# EAGLE design IFB-40002-R01 - I2C_Joystick (EAGLE 9.6.2)
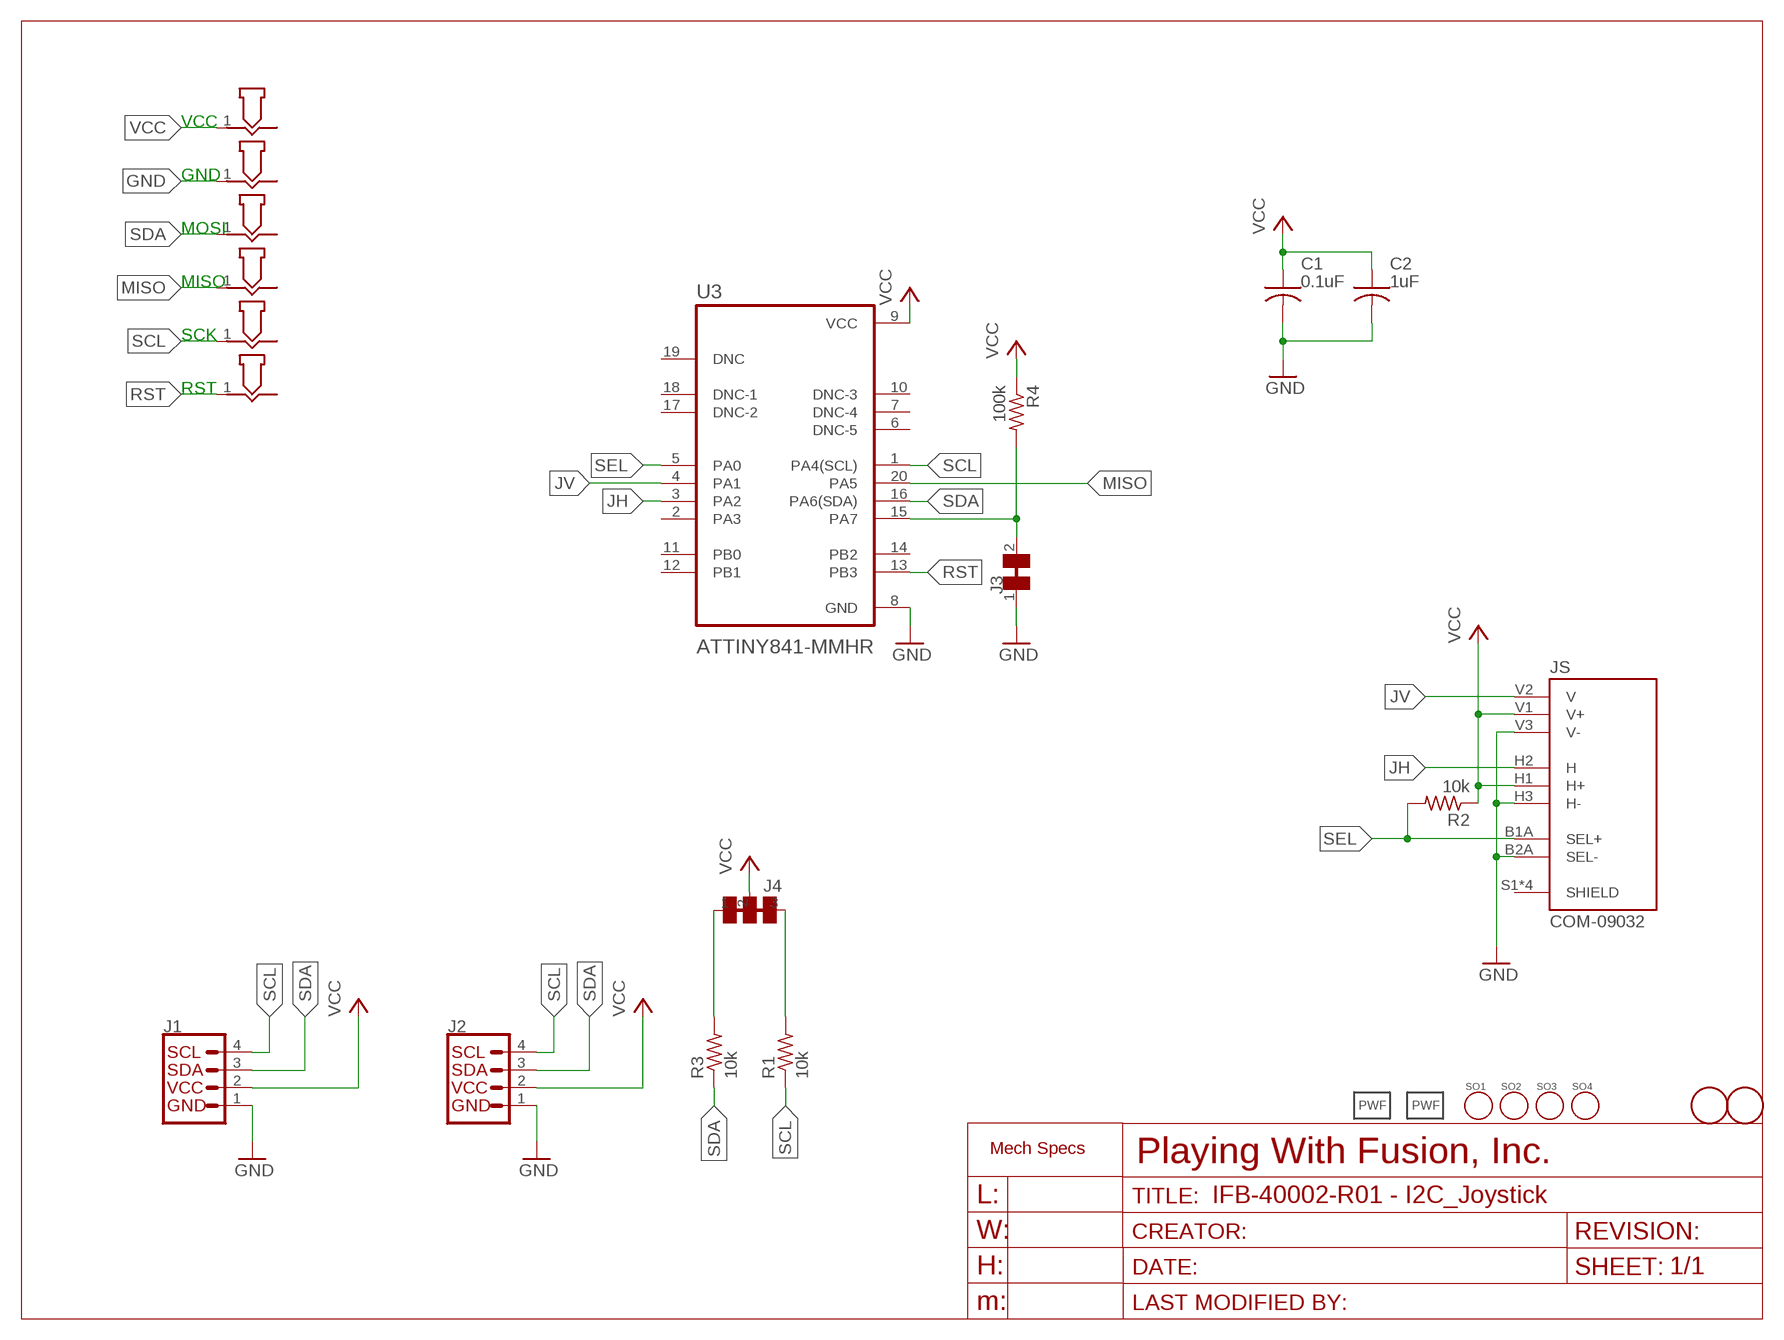
[diagram p0: schematic, sheet 1]

## Parts
C1  0.1uF  C-USC0603K  [C0603K]
C2  1uF  C-USC0603K  [C0603K]
GND  POGO_PAD  [P50_POGO_BOARD_CONTACT_12MIL]
J1  QWIIC_CONNECTORJS-1MM  [1X04_1MM_RA]
J2  QWIIC_CONNECTORJS-1MM  [1X04_1MM_RA]
J3  CUTTABLE_JUMPER  [SMT_CUTTABLE_JUMPER]
J4  CUT_JUMPER_2X  [SMT_2X_CUTTABLE_JUMPER]
JS  COM-09032  [XDCR_COM-09032]
LOGO1  PWF_LOGOPWF-6MM-SS  [LOGO_6MM_STEIN]
LOGO2  PWF_LOGOPWF-6MM-SS  [LOGO_6MM_STEIN]
MISO  POGO_PAD  [P50_POGO_BOARD_CONTACT_12MIL]
MOSI  POGO_PAD  [P50_POGO_BOARD_CONTACT_12MIL]
R1  10k  R-US_R0603  [R0603]
R2  10k  R-US_R0603  [R0603]
R3  10k  R-US_R0603  [R0603]
R4  100k  R-US_R0603  [R0603]
RST  POGO_PAD  [P50_POGO_BOARD_CONTACT_12MIL]
SCK  POGO_PAD  [P50_POGO_BOARD_CONTACT_12MIL]
SO1  STAND_OFFNO4_TIGHT  [STANDOFF_NO4_TIGHT]
SO2  STAND_OFFNO4_TIGHT  [STANDOFF_NO4_TIGHT]
SO3  STAND_OFFNO4_TIGHT  [STANDOFF_NO4_TIGHT]
SO4  STAND_OFFNO4_TIGHT  [STANDOFF_NO4_TIGHT]
U3  ATTINY841-MMHR  [QFN45P300X300X85-21N]
U$2  FIDUCIAL  [FIDUCIAL_1MM]
U$3  FIDUCIAL  [FIDUCIAL_1MM]
VCC  POGO_PAD  [P50_POGO_BOARD_CONTACT_12MIL]

## Nets
GND: C1.2 C2.2 GND.1 J1.1(GND) J2.1(GND) J3.1 JS.B2A(SEL-) JS.H3(H-) JS.V3(V-) U3.8(GND)
JH: JS.H2(H) U3.3(PA2)
JV: JS.V2(V) U3.4(PA1)
MISO: MISO.1 U3.20(PA5)
N$1: J3.2 R4.2 U3.15(PA7)
N$2: J4.1 R3.2
N$3: J4.3 R1.2
RST: RST.1 U3.13(PB3)
SCL: J1.4(SCL) J2.4(SCL) R1.1 SCK.1 U3.1(PA4(SCL))
SDA: J1.3(SDA) J2.3(SDA) MOSI.1 R3.1 U3.16(PA6(SDA))
SEL: JS.B1A(SEL+) R2.2 U3.5(PA0)
VCC: C1.1 C2.1 J1.2(VCC) J2.2(VCC) J4.2 JS.H1(H+) JS.V1(V+) R2.1 R4.1 U3.9(VCC) VCC.1
Unconnected: JS.S1(SHIELD) JS.S2(SHIELD) JS.S3(SHIELD) JS.S4(SHIELD) U3.2(PA3) U3.6(DNC-5) U3.7(DNC-4) U3.10(DNC-3) U3.11(PB0) U3.12(PB1) U3.14(PB2) U3.17(DNC-2) U3.18(DNC-1) U3.19(DNC)

## Notes on the sheet
- VCC
- GND
- MOSI
- MISO
- SCK
- RST

## Library data of the parts
C1 C2 = rcl:C-US: CAPACITOR, American symbol; SPICEPREFIX: C
GND MISO MOSI RST SCK VCC = PlayingWithFusion_Breakout-Lib:POGO_PAD
J1 J2 = SparkFun-Connectors:QWIIC_CONNECTOR: SparkFun I2C Standard Qwiic Connector An SMD 1mm pitch JST connector makes it easy and quick (get it? Qwiic?) to connect I2C devices to each other. The Qwiic system <http://www.sparkfun.com/qwiic> enables fast and solderless connection between popular platforms and various sensors and actuators. We carry 200mm <https://www.sparkfun.com/products/14204>, 100mm <https://www.sparkfun.com/products/14205>, 50mm <https://www.sparkfun.com/products/14206>, and breadboard friendly <https://www.sparkfun.com/products/14207> Qwiic cables. We also offer 10 pcs strips <https://www.sparkfun.com/products/14323> the SMD connectors.
J3 = PlayingWithFusion_Breakout-Lib:CUTTABLE_JUMPER
J4 = PlayingWithFusion_Breakout-Lib:CUT_JUMPER_2X
JS = COM-09032:COM-09032: Thumb Joystick Check availability <https://pricing.snapeda.com/parts/COM-09032/SparkFun%20Electronics/view-part?ref=eda>; AVAILABILITY: In Stock; DESCRIPTION: Joystick, 2 - Axis Analog (Resistive) Output; MF: SparkFun Electronics; MP: COM-09032; PACKAGE: SparkFun Electronics; PRICE: None; PURCHASE-URL: https://pricing.snapeda.com/search/part/COM-09032/?ref=eda
LOGO1 LOGO2 = PlayingWithFusion_Logo:PWF_LOGO
R1-R4 = rcl:R-US_: RESISTOR, American symbol; SPICEPREFIX: R
SO1-SO4 = PlayingWithFusion_Breakout-Lib:STAND_OFF: Stand Off This is the mechanical footprint for a #4 phillips button head screw. Use the keepout ring to avoid running the screw head into surrounding components. SKU : PRT-00447
U3 = ATTINY841-MMHR:ATTINY841-MMHR: None Check availability <https://pricing.snapeda.com/parts/ATTINY841-MMHR/Microchip/view-part?ref=eda>; AVAILABILITY: In Stock; DESCRIPTION: AVR AVR® ATtiny Microcontroller IC 8-Bit 16MHz 8KB (8K x 8) FLASH 20-VQFN (3x3); MF: Microchip; MP: ATTINY841-MMHR; PACKAGE: DFN-20 Microchip; PRICE: None; PURCHASE-URL: https://pricing.snapeda.com/search/part/ATTINY841-MMHR/?ref=eda
U$2 U$3 = PlayingWithFusion_Breakout-Lib:FIDUCIAL: For use by pick and place machines to calibrate the vision/machine, 1mm By microbuilder.eu

## Board
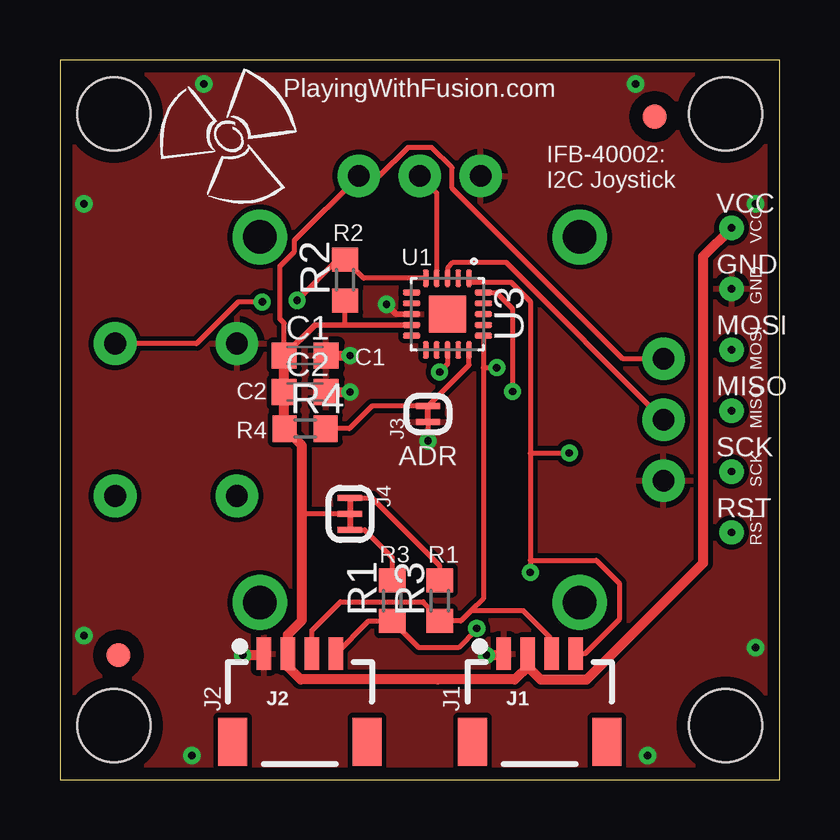
[diagram p1: board, top side]
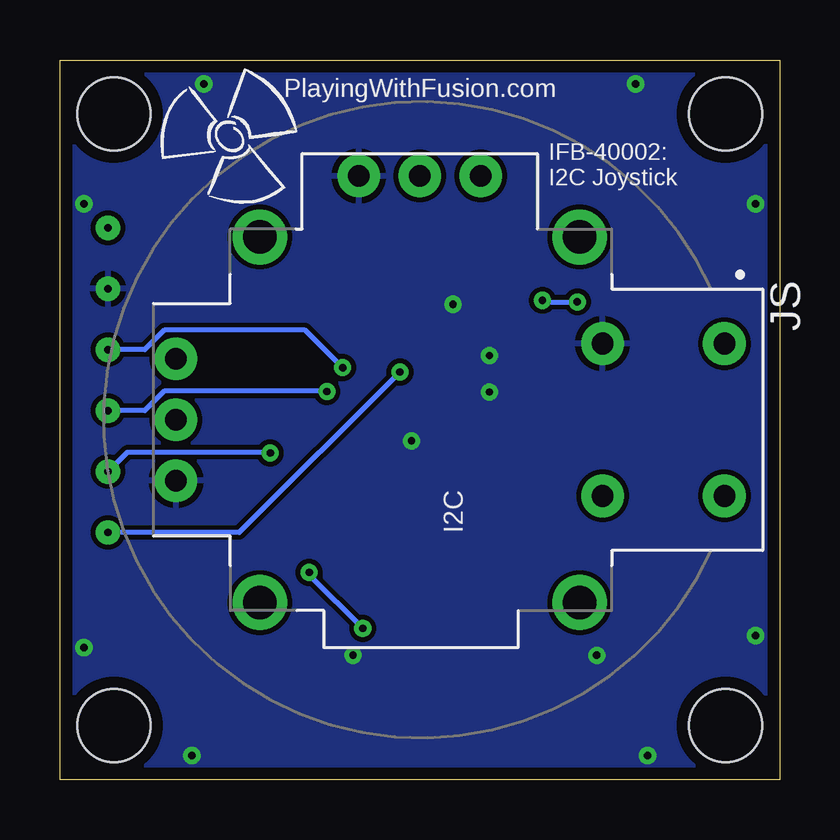
[diagram p2: board, bottom side, seen from below]

Size 30 x 30 mm. Coordinates in mm from the lower left corner, seen from the top.
Outline: 0,0 30,0 30,30 0,30 0,0
Copper layers (1*16): Top 0.035mm / dielectric 1.5mm / Bottom 0.035mm
Design rules "default *": minimum track width 8mil, minimum drill 12mil, track to track 8mil, track to pad 8mil, pad to pad 8mil, via to via 8mil, smd to smd 8mil, copper to edge 20mil, drill to drill 6mil, minimum pad ring 10mil, minimum via ring 8mil, stop-mask expansion 4mil, vias tented up to drill 17mil, thermal gap 10mil

### Footprints (pad centres in the part's own frame; a part is rotated, then mirrored left to right if it is on the bottom)
C0603K = smd 1.05 x 1.08: 1 -0.875,0; 2 0.875,0
P50_POGO_BOARD_CONTACT_12MIL = drill 0.305 pad 1.016: 1 0,0
1X04_1MM_RA = smd 0.6 x 1.35: 1 -1.5,0; 2 -0.5,0; 3 0.5,0; 4 1.5,0 | smd 1.2 x 2: NC1 2.8,-3.675; NC2 -2.8,-3.675
SMT_CUTTABLE_JUMPER = smd 0.254 x 1.016: 1 -0.33,0; 2 0.33,0
SMT_2X_CUTTABLE_JUMPER = smd 0.254 x 1.016: 1 -0.66,0; 2 0,0; 3 0.66,0
XDCR_COM-09032 = drill 0.9 pad 1.778: B1A -3.175,12.7; B1B 3.175,12.7; B2A -3.175,7.62; B2B 3.175,7.62 | drill 0.889 pad 1.778: H1 -2.54,-10.16; H2 0,-10.16; H3 2.54,-10.16; V1 -10.16,2.54; V2 -10.16,0; V3 -10.16,-2.54 | drill 1.397 pad 2.286: S1 -7.62,6.668; S2 -7.62,-6.668; S3 7.62,-6.668; S4 7.62,6.668
R0603 = smd 1 x 1.1: 1 -0.85,0; 2 0.85,0
STANDOFF_NO4_TIGHT = hole 3.048: 0,0
QFN45P300X300X85-21N = smd 0.72 x 0.24: 1 -1.495,0.9; 2 -1.495,0.45; 3 -1.495,0; 4 -1.495,-0.45; 5 -1.495,-0.9; 11 1.495,-0.9; 12 1.495,-0.45; 13 1.495,0; 14 1.495,0.45; 15 1.495,0.9 | smd 0.24 x 0.72: 6 -0.9,-1.495; 7 -0.45,-1.495; 8 0,-1.495; 9 0.45,-1.495; 10 0.9,-1.495; 16 0.9,1.495; 17 0.45,1.495; 18 0,1.495; 19 -0.45,1.495; 20 -0.9,1.495 | smd 1.55 x 1.55: 21 0,0
FIDUCIAL_1MM = smd 1 x 1: 1 0,0

### Placement (x,y rotation side)
C1  10.22,17.68 0 top
C2  10.22,16.15 0 top
GND  28,20.46 0 top
J1  20,5.25 0 top
J2  10,5.25 0 top
J3  15.34,15.24 90 top
J4  12.09,11.07 270 top
JS  15,15 270 bottom
LOGO1  7.01,26.82 0 top
LOGO2  22.96,26.82 0 bottom
MISO  28,15.38 0 top
MOSI  28,17.92 0 top
R1  13.85,7.46 90 top
R2  11.89,20.83 90 top
R3  15.83,7.46 90 top
R4  10.22,14.63 0 top
RST  28,10.3 0 top
SCK  28,12.84 0 top
SO1  27.75,2.25 0 top
SO2  2.25,27.75 0 top
SO3  27.75,27.75 0 top
SO4  2.25,2.25 0 top
U3  16.15,19.41 270 top
U$2  24.79,27.64 0 top
U$3  2.44,5.18 0 top
VCC  28,23 0 top

### Tracks (layer width: path | path; a pad name or v marks a point on that pad's centre or on a via)
GND  (via drill 0.3)
  Top 0.203: J3.1 v15.34,14.12
  Top 0.229: U3.8 14.02,19.41 v13.61,19.81
  Top 0.406: C1.2 v12.09,17.68 | C2.2 v12.09,16.15 | J2.1 8.43,5.18 v7.62,5.18 | J1.1 18.43,5.18 v17.78,5.18
  other vias: 5.5,1 24.5,1 29,5.5 29,24 24,29 6,29 1,24 1,6
  pour Bottom: 0,30 0,0 30,0 30,30
  pour Top: 0,30 0,0 30,0 30,30
JH
  Top 0.203: U3.3 16.18,20.93 16.18,21.35 16.39,21.57 18.59,21.57 JS.H2
JV
  Top 0.203: JS.V2 15.7,24.46 U3.4
MISO  (via drill 0.3)
  Top 0.203: U3.20 18.2,20.31 18.87,19.63 v18.87,16.18
  Bottom 0.203: MISO.1 26.47,15.38 25.65,16.19 18.89,16.19 v18.87,16.18
N$1
  Top 0.203: R4.2 12.06,14.63 13.01,15.57 J3.2 17.05,17.28 U3.15
N$2
  Top 0.203: R3.2 15.83,8.91 13.01,11.73 J4.1
N$3
  Top 0.203: J4.3 12.7,10.41 13.85,9.26 R1.2
RST  (via drill 0.3)
  Top 0.203: U3.13 16.15,17.32 v15.83,16.99
  Bottom 0.203: v15.83,16.99 22.52,10.3 RST.1
SCL  (via drill 0.3)
  Top 0.203: 11.5,5.74 J2.4 12.86,6.61 R1.1 14.96,5.5 16.61,5.5 17.37,6.26 v17.37,6.3 | J1.4 21.89,5.25 23.32,6.68 23.32,8.18 22.36,9.14 19.61,9.14 | U3.1 17.23,20.73 18.81,20.73 19.61,19.93 19.61,13.61 | 19.61,13.61 19.61,9.14 | 19.61,9.14 v19.61,8.64 | 19.61,13.61 v21.23,13.61
  Bottom 0.203: v19.61,8.64 19.61,8.53 v17.37,6.3 | SCK.1 27.19,13.65 21.27,13.65 v21.23,13.61
SDA  (via drill 0.3)
  Top 0.203: J2.3 10.5,6.22 11.69,7.41 15.14,7.41 15.83,6.72 R3.1 16.71,6.61 17.14,7.03 | U3.16 17.65,17.17 | 17.65,17.17 v18.21,17.17 | 17.14,7.03 19.33,7.03 20.41,5.95 20.41,5.34 J1.3 | 17.65,17.17 17.65,7.54 17.14,7.03
  Bottom 0.203: MOSI.1 26.47,17.92 25.65,18.73 19.78,18.73 v18.21,17.17
SEL  (via drill 0.3)
  Top 0.203: U3.5 12.66,20.9 R2.2 11.58,21.68 v9.88,19.98 | JS.B1A 5.69,18.18 7.43,19.91 v8.43,19.91
  Bottom 0.203: v9.88,19.98 9.82,19.91 v8.43,19.91
VCC
  Top 0.203: 11.89,18.96 R2.1 | C1.1 9.35,19.02 9.17,19.2 9.17,21.41 9.78,22.02 9.78,22.48 JS.V1 13.31,25.16 14.51,26.35 15.49,26.35 16.35,25.5 16.35,24.67 23.47,17.54 JS.H1 | J4.2 10.09,11.07
  Top 0.229: C1.1 10.63,18.96 11.89,18.96 U3.9
  Top 0.406: C1.1 C2.1 9.35,14.65 R4.1 10.09,13.92 10.09,11.07 10.09,6.64 9.5,6.05 J2.2 9.5,5.05 9.49,5.04 9.49,4.71 10.03,4.17 15.75,4.17 18.97,4.17 19.5,4.7 | VCC.1 26.82,21.82 26.82,9.02 21.97,4.17 20.03,4.17 19.5,4.7 | J1.2 19.5,4.7

### Text on the board
tPlace: PlayingWithFusion.com | IFB-40002: / I2C Joystick | R2 | VCC | U1 | GND | C2 | C1 | MOSI | R4 | MISO | ADR | SCK | RST | R3 | R1 | J2 | J1
bPlace: PlayingWithFusion.com | IFB-40002: / I2C Joystick | I2C